# EAGLE schematic internal_env_board (EAGLE 8.0.1)
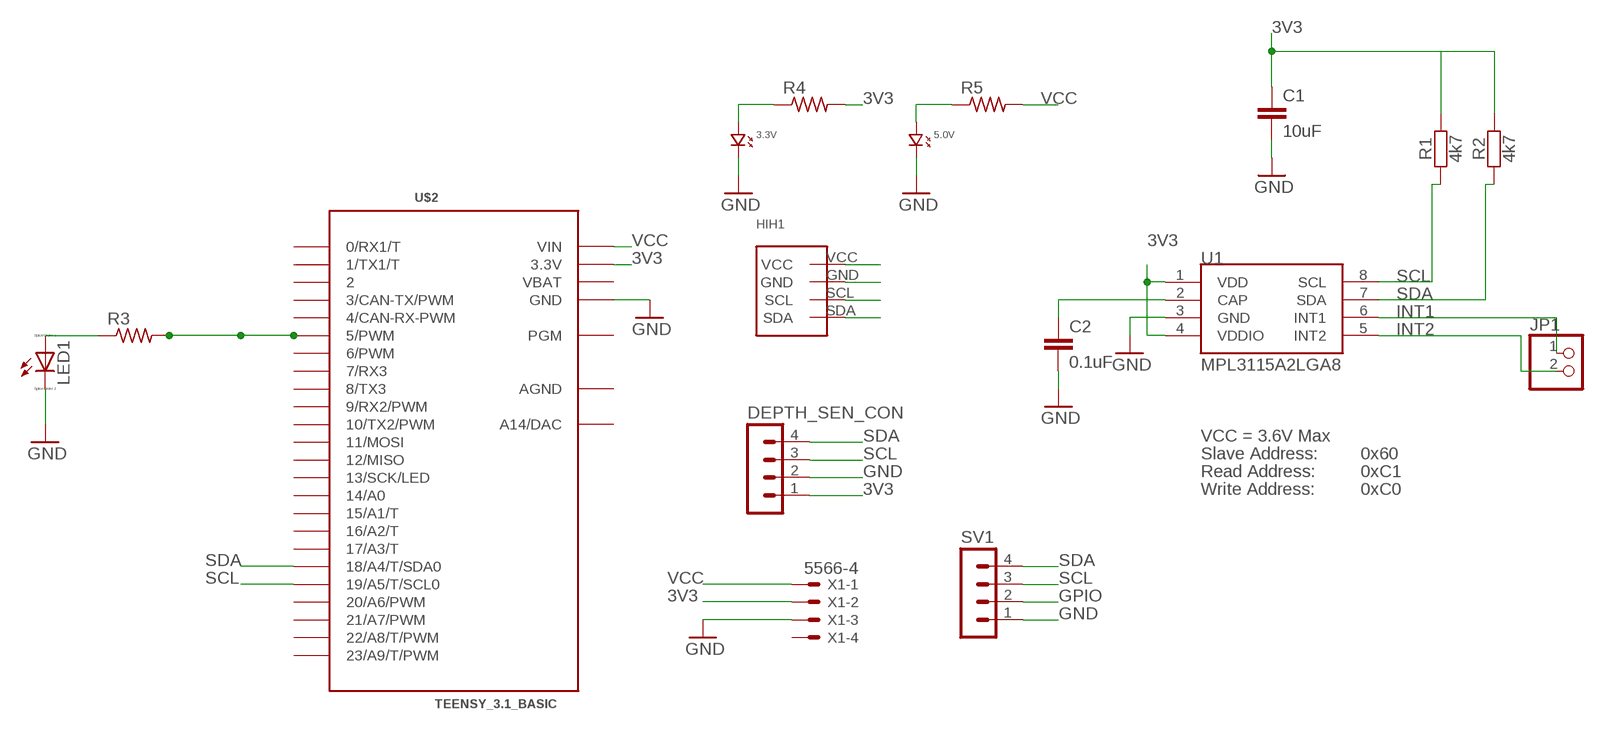
[diagram p0: schematic, sheet 1]

## Parts
3.3V  LED.0805  [0805.LED]
5.0V  LED.0805  [0805.LED]
C1  10uF  CAP0805  [0805]
C2  0.1uF  CAP0805  [0805]
DEPTH_SEN_CON  MA04-1  [MA04-1]
HIH1  HIH7120  [SIP4]
JP1  PINHD-1X2  [1X02]
LED1  LED_E  [LED_1206]
R1  4k7  RESISTOR-R0805  [R0805]
R2  4k7  RESISTOR-R0805  [R0805]
R3  R-US_M1206  [M1206]
R4  R-US_R0805  [R0805]
R5  R-US_R0805  [R0805]
SV1  MA04-1  [MA04-1]
U1  MPL3115A2LGA8  [LGA8]
U$2  TEENSY_3.1_BASIC  [TEENSY_3.1_BASIC]
X1  5566-4  [5566-4]

## Nets
3V3: C1.1 DEPTH_SEN_CON.1 HIH1.VCC R1.2 R2.2 R4.2 U1.1(VDD) U1.4(VDDIO) U$2.3.3V U$2.3.3V1(3.3V) X1.2
GND: 3.3V.P$2 5.0V.P$2 C1.2 C2.2 DEPTH_SEN_CON.2 HIH1.GND LED1.C SV1.1 U1.3(GND) U$2.GND U$2.GND1(GND) X1.3
GPIO: R3.2 SV1.2 U$2.5(5/PWM)
INT1: JP1.1 U1.6(INT1)
INT2: JP1.2 U1.5(INT2)
N$3: C2.1 U1.2(CAP)
N$8: 5.0V.P$1 R5.1
N$9: LED1.A R3.1
N$17: 3.3V.P$1 R4.1
SCL: DEPTH_SEN_CON.3 HIH1.SCL R1.1 SV1.3 U1.8(SCL) U$2.19/A5(19/A5/T/SCL0)
SDA: DEPTH_SEN_CON.4 HIH1.SDA R2.1 SV1.4 U1.7(SDA) U$2.18/A4(18/A4/T/SDA0)
VCC: R5.2 U$2.VIN X1.1
Unconnected: U$2.0(0/RX1/T) U$2.1(1/TX1/T) U$2.2 U$2.3(3/CAN-TX/PWM) U$2.4(4/CAN-RX-PWM) U$2.6(6/PWM) U$2.7(7/RX3) U$2.8(8/TX3) U$2.9(9/RX2/PWM) U$2.10(10/TX2/PWM) U$2.11(11/MOSI) U$2.12(12/MISO) U$2.13(13/SCK/LED) U$2.14/A0 U$2.15/A1(15/A1/T) U$2.16/A2(16/A2/T) U$2.17/A3(17/A3/T) U$2.20/A6(20/A6/PWM) U$2.21/A7(21/A7/PWM) U$2.22/A8(22/A8/T/PWM) U$2.23/A9(23/A9/T/PWM) U$2.A14(A14/DAC) U$2.PGM X1.4

## Notes on the sheet
- VCC = 3.6V Max
- Slave Address: | 0x60
- Read Address: | 0xC1
- Write Address: | 0xC0

## Power pins joined to a net without a drawn wire
AGND: U$2.AGND
VBAT: U$2.VBAT

## Library data of the parts
3.3V 5.0V = standardparts:LED
C1 C2 = SparkFun:CAP: Capacitor Standard 0603 ceramic capacitor, and 0.1" leaded capacitor.
DEPTH_SEN_CON SV1 = con-lstb:MA04-1: PIN HEADER; OC_FARNELL: unknown; OC_NEWARK: unknown
HIH1 = HIH7120:HIH7120: A humidity and temperature sensor from honeywell. 2.3-5V operating voltage -40 to 85 temperature range Digikey Part #: HIH7120-021-001CT-ND
JP1 = pinhead:PINHD-1X2: PIN HEADER
LED1 = eagle-ltspice:LED_E: LED Source: http://www.osram.convergy.de Source: www.luxeon.com Source: www.kingbright.com; SPICEMODEL: NONE; SPICEPREFIX: D; SPICETYPE: diode
R1 R2 = we-rcl:RESISTOR: Resistors all kinds in 0603 and 0402
R3 = resistor:R-US_: RESISTOR, American symbol
R4 R5 = rcl:R-US_: RESISTOR, American symbol
U1 = SparkFun-Sensors:MPL3115A2: Altimeter/Pressure Sensor, I2C, 1.95V-3.6V supply, 50 to 110kPa
U$2 = Teensy_3_Series_Board_v1.0:TEENSY_3.1_BASIC: Footprint for Teensy 3.1 board using all pin connections on the outer perimeter
X1 = con-molex:5566-4: Mini FIT connector 4 pol Source: http://www.molex.com; OC_FARNELL: unknown; OC_NEWARK: unknown

## Net classes
0 default: clearance 0.152 mm